# EAGLE design midi-switcher-dpdt (EAGLE 6.6.0)
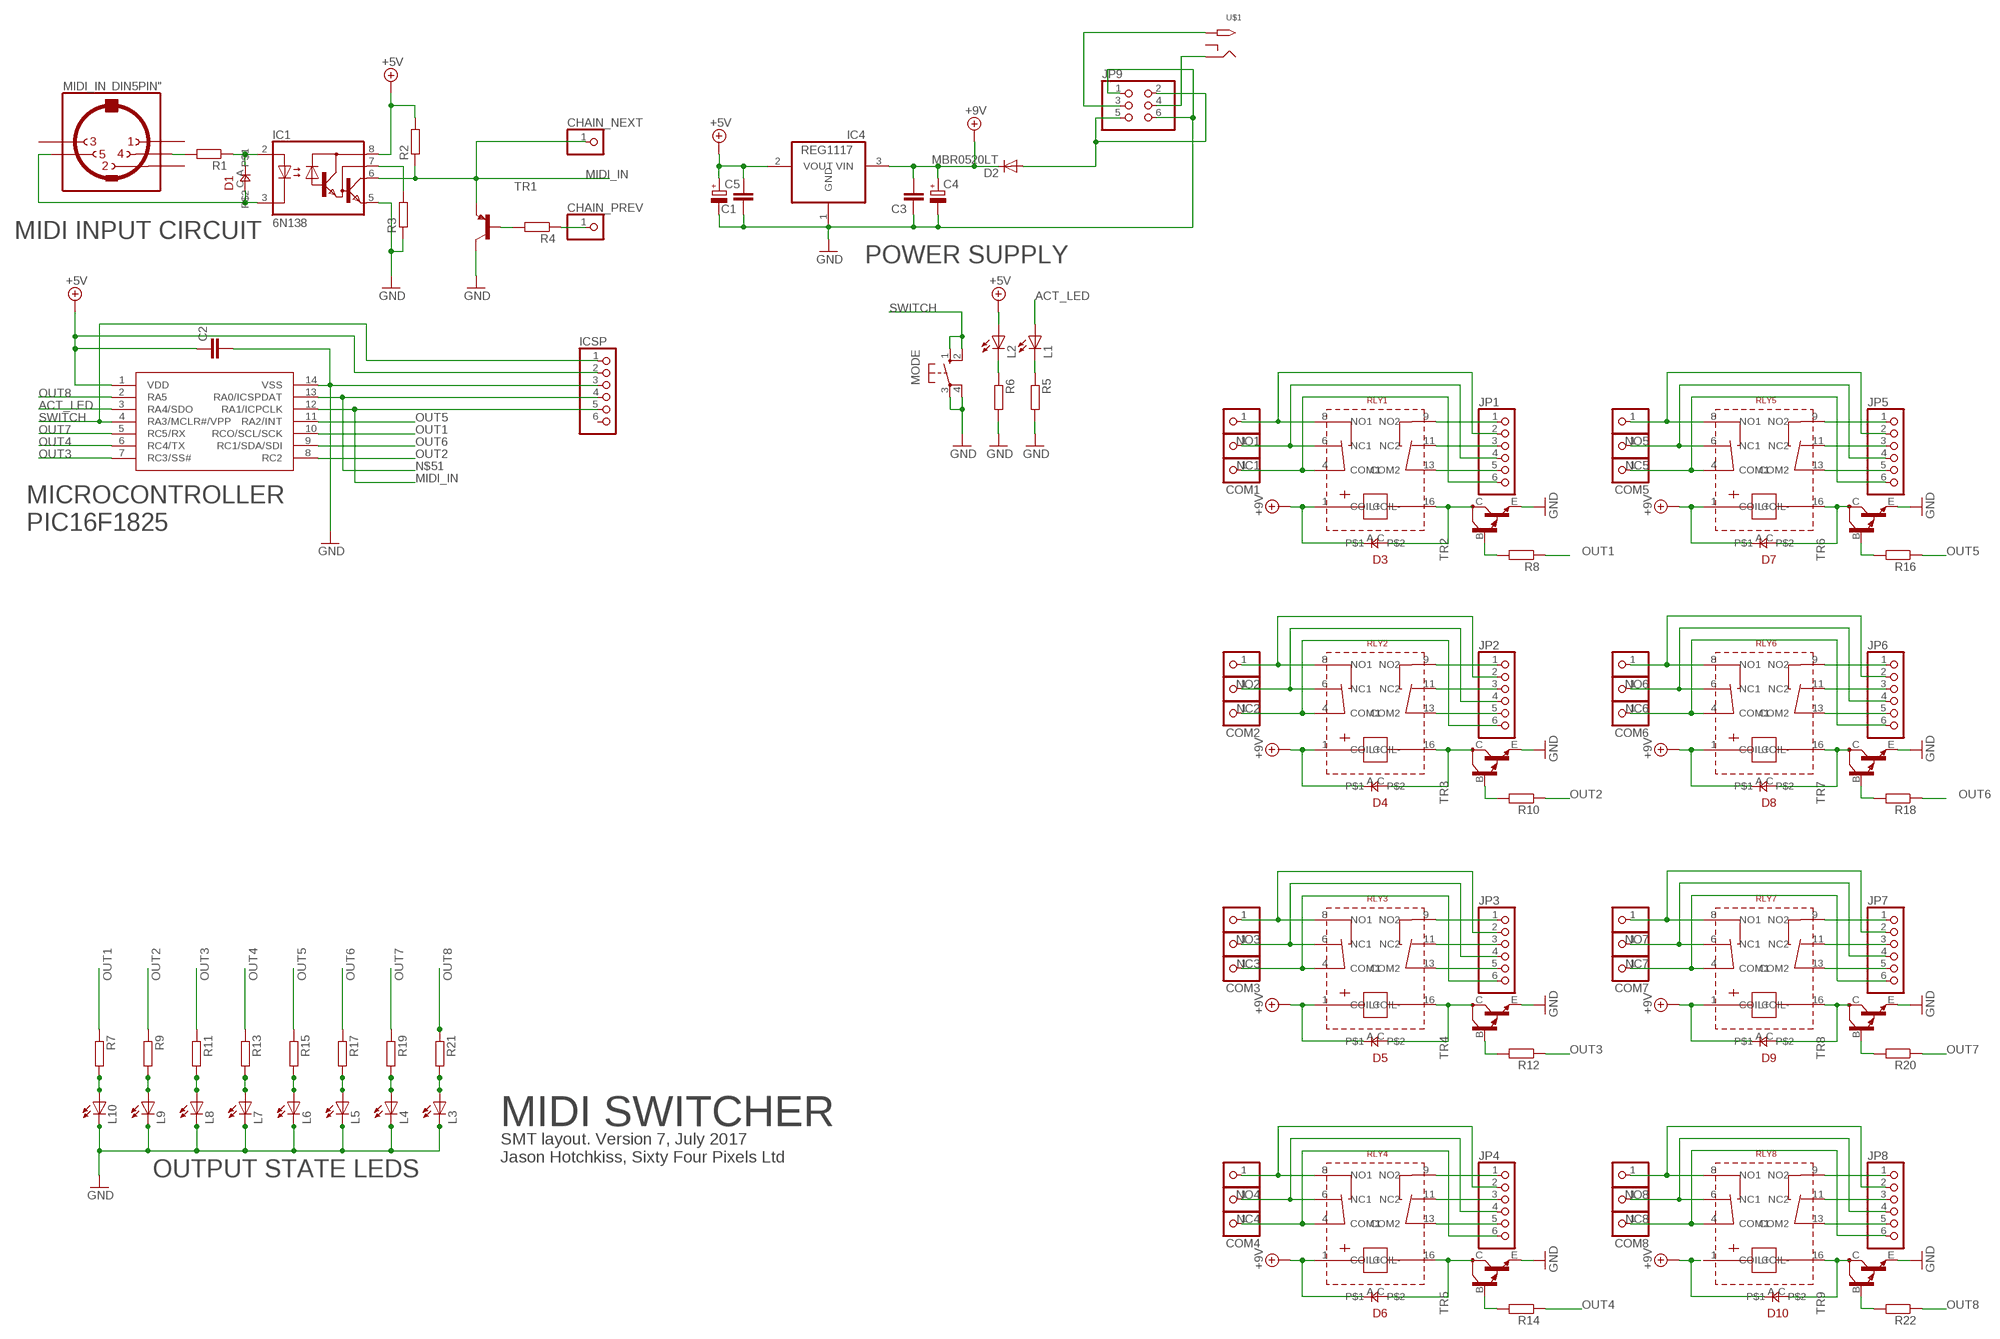
[diagram p0: schematic, sheet 1]

## Parts
C1  C-EUC0805  [C0805]
C2  C-EUC0805  [C0805]
C3  C-EUC0805  [C0805]
C4  CPOL-EUE2,5-6E  [E2,5-6E]
C5  CPOL-EUE2,5-6E  [E2,5-6E]
CHAIN_NEXT  PINHD-1X1  [1X01]
CHAIN_PREV  PINHD-1X1  [1X01]
COM1  PINHD-1X1  [1X01]
COM2  PINHD-1X1  [1X01]
COM3  PINHD-1X1  [1X01]
COM4  PINHD-1X1  [1X01]
COM5  PINHD-1X1  [1X01]
COM6  PINHD-1X1  [1X01]
COM7  PINHD-1X1  [1X01]
COM8  PINHD-1X1  [1X01]
D1  0805DIODE  [0805DIODE]
D2  MBR0520LT  [SOD123]
D3  0805DIODE  [0805DIODE]
D4  0805DIODE  [0805DIODE]
D5  0805DIODE  [0805DIODE]
D6  0805DIODE  [0805DIODE]
D7  0805DIODE  [0805DIODE]
D8  0805DIODE  [0805DIODE]
D9  0805DIODE  [0805DIODE]
D10  0805DIODE  [0805DIODE]
IC1  6N138  [DIL08]
IC2  PIC16F1825SO14  [SO14]
IC4  REG1117  [SOT223]
ICSP  HEADER-1X6  [1X06_OVAL]
JP1  PINHD-1X6  [1X06]
JP2  PINHD-1X6  [1X06]
JP3  PINHD-1X6  [1X06]
JP4  PINHD-1X6  [1X06]
JP5  PINHD-1X6  [1X06]
JP6  PINHD-1X6  [1X06]
JP7  PINHD-1X6  [1X06]
JP8  PINHD-1X6  [1X06]
JP9  PINHD-2X3  [2X03]
L1  LEDCHIP-LED0805  [CHIP-LED0805]
L2  LEDCHIP-LED0805  [CHIP-LED0805]
L3  LEDCHIP-LED0805  [CHIP-LED0805]
L4  LEDCHIP-LED0805  [CHIP-LED0805]
L5  LEDCHIP-LED0805  [CHIP-LED0805]
L6  LEDCHIP-LED0805  [CHIP-LED0805]
L7  LEDCHIP-LED0805  [CHIP-LED0805]
L8  LEDCHIP-LED0805  [CHIP-LED0805]
L9  LEDCHIP-LED0805  [CHIP-LED0805]
L10  LEDCHIP-LED0805  [CHIP-LED0805]
MIDI_IN  DIN5PIN"  [TRUCONN90]
MODE  10-XX  [B3F-10XX]
NC1  PINHD-1X1  [1X01]
NC2  PINHD-1X1  [1X01]
NC3  PINHD-1X1  [1X01]
NC4  PINHD-1X1  [1X01]
NC5  PINHD-1X1  [1X01]
NC6  PINHD-1X1  [1X01]
NC7  PINHD-1X1  [1X01]
NC8  PINHD-1X1  [1X01]
NO1  PINHD-1X1  [1X01]
NO2  PINHD-1X1  [1X01]
NO3  PINHD-1X1  [1X01]
NO4  PINHD-1X1  [1X01]
NO5  PINHD-1X1  [1X01]
NO6  PINHD-1X1  [1X01]
NO7  PINHD-1X1  [1X01]
NO8  PINHD-1X1  [1X01]
R1  R-EU_R0805  [R0805]
R2  R-EU_R0805  [R0805]
R3  R-EU_R0805  [R0805]
R4  R-EU_R0805  [R0805]
R5  R-EU_R0805  [R0805]
R6  R-EU_R0805  [R0805]
R7  R-EU_R0805  [R0805]
R8  R-EU_R0805  [R0805]
R9  R-EU_R0805  [R0805]
R10  R-EU_R0805  [R0805]
R11  R-EU_R0805  [R0805]
R12  R-EU_R0805  [R0805]
R13  R-EU_R0805  [R0805]
R14  R-EU_R0805  [R0805]
R15  R-EU_R0805  [R0805]
R16  R-EU_R0805  [R0805]
R17  R-EU_R0805  [R0805]
R18  R-EU_R0805  [R0805]
R19  R-EU_R0805  [R0805]
R20  R-EU_R0805  [R0805]
R21  R-EU_R0805  [R0805]
R22  R-EU_R0805  [R0805]
RLY1  HFD2RELAY  [HFD2RELAY]
RLY2  HFD2RELAY  [HFD2RELAY]
RLY3  HFD2RELAY  [HFD2RELAY]
RLY4  HFD2RELAY  [HFD2RELAY]
RLY5  HFD2RELAY  [HFD2RELAY]
RLY6  HFD2RELAY  [HFD2RELAY]
RLY7  HFD2RELAY  [HFD2RELAY]
RLY8  HFD2RELAY  [HFD2RELAY]
TR1  MMBT3906LT1-PNP-SOT23-BEC  [SOT23-BEC]
TR2  MMBTA13LT1-NPN_DARL-SOT23-BEC  [SOT23-BEC]
TR3  MMBTA13LT1-NPN_DARL-SOT23-BEC  [SOT23-BEC]
TR4  MMBTA13LT1-NPN_DARL-SOT23-BEC  [SOT23-BEC]
TR5  MMBTA13LT1-NPN_DARL-SOT23-BEC  [SOT23-BEC]
TR6  MMBTA13LT1-NPN_DARL-SOT23-BEC  [SOT23-BEC]
TR7  MMBTA13LT1-NPN_DARL-SOT23-BEC  [SOT23-BEC]
TR8  MMBTA13LT1-NPN_DARL-SOT23-BEC  [SOT23-BEC]
TR9  MMBTA13LT1-NPN_DARL-SOT23-BEC  [SOT23-BEC]
U$1  2.1MMJACKTHM  [PJ-102A]

## Nets
+5V: C1.2 C2.1 C5.+ IC1.8(VCC) IC2.1(VDD) IC4.2(VOUT) ICSP.2 L2.A R2.2
+9V: C3.2 C4.+ D2.C D3.A D4.A D5.A D6.A D7.A D8.A D9.A D10.A IC4.3(VIN) RLY1.1(COIL+) RLY2.1(COIL+) RLY3.1(COIL+) RLY4.1(COIL+) RLY5.1(COIL+) RLY6.1(COIL+) RLY7.1(COIL+) RLY8.1(COIL+)
ACT_LED: IC2.3(RA4/SDO) L1.A
GND: C1.1 C2.2 C3.1 C4.- C5.- IC1.5(GND) IC2.14(VSS) IC4.1(GND) ICSP.3 JP9.1 JP9.6 L3.C L4.C L5.C L6.C L7.C L8.C L9.C L10.C MODE.3(P) MODE.4(P1) R3.1 R5.2 R6.2 TR1.C TR2.E TR3.E TR4.E TR5.E TR6.E TR7.E TR8.E TR9.E
MIDI_IN: CHAIN_NEXT.1 IC1.6(VO) IC2.12(RA1/ICPCLK) ICSP.5 R2.1 TR1.E
N$1: D1.C IC1.3(C) MIDI_IN.5
N$2: MIDI_IN.4 R1.2
N$3: D1.A IC1.2(A) R1.1
N$4: IC1.7(VB) R3.2
N$5: L1.C R5.1
N$6: L10.A R7.2
N$7: L9.A R9.2
N$8: D3.C RLY1.16(COIL-) TR2.C
N$9: R8.2 TR2.B
N$10: JP9.3 U$1.TIP
N$11: D4.C RLY2.16(COIL-) TR3.C
N$12: R10.2 TR3.B
N$13: JP9.4 U$1.RING
N$14: D5.C RLY3.16(COIL-) TR4.C
N$15: R12.2 TR4.B
N$16: R4.2 TR1.B
N$18: CHAIN_PREV.1 R4.1
N$19: D6.C RLY4.16(COIL-) TR5.C
N$20: R14.2 TR5.B
N$21: D2.A JP9.2 JP9.5
N$23: JP1.2 NO1.1 RLY1.8(NO1)
N$24: L8.A R11.2
N$25: JP1.4 NC1.1 RLY1.6(NC1)
N$26: JP5.5 RLY5.13(COM2)
N$27: JP2.2 NO2.1 RLY2.8(NO1)
N$28: L2.C R6.1
N$29: JP2.4 NC2.1 RLY2.6(NC1)
N$30: COM2.1 JP2.6 RLY2.4(COM1)
N$31: JP3.2 NO3.1 RLY3.8(NO1)
N$32: JP3.4 NC3.1 RLY3.6(NC1)
N$33: L7.A R13.2
N$34: COM3.1 JP3.6 RLY3.4(COM1)
N$35: L6.A R15.2
N$36: L5.A R17.2
N$37: L4.A R19.2
N$38: L3.A R21.2
N$39: JP4.2 NO4.1 RLY4.8(NO1)
N$40: JP4.4 NC4.1 RLY4.6(NC1)
N$41: COM4.1 JP4.6 RLY4.4(COM1)
N$42: JP5.2 NO5.1 RLY5.8(NO1)
N$43: JP5.4 NC5.1 RLY5.6(NC1)
N$44: COM5.1 JP5.6 RLY5.4(COM1)
N$45: JP6.2 NO6.1 RLY6.8(NO1)
N$46: JP6.4 NC6.1 RLY6.6(NC1)
N$47: COM6.1 JP6.6 RLY6.4(COM1)
N$48: JP7.2 NO7.1 RLY7.8(NO1)
N$49: JP7.4 NC7.1 RLY7.6(NC1)
N$50: COM7.1 JP7.6 RLY7.4(COM1)
N$51: IC2.13(RA0/ICSPDAT) ICSP.4
N$52: JP8.2 NO8.1 RLY8.8(NO1)
N$53: JP8.4 NC8.1 RLY8.6(NC1)
N$55: COM8.1 JP8.6 RLY8.4(COM1)
N$56: D7.C RLY5.16(COIL-) TR6.C
N$57: R16.2 TR6.B
N$59: D8.C RLY6.16(COIL-) TR7.C
N$60: R18.2 TR7.B
N$62: D9.C RLY7.16(COIL-) TR8.C
N$63: R20.2 TR8.B
N$65: D10.C RLY8.16(COIL-) TR9.C
N$66: R22.2 TR9.B
N$68: JP5.3 RLY5.11(NC2)
N$69: JP1.5 RLY1.13(COM2)
N$70: JP1.3 RLY1.11(NC2)
N$71: JP1.1 RLY1.9(NO2)
N$72: JP5.1 RLY5.9(NO2)
N$73: COM1.1 JP1.6 RLY1.4(COM1)
N$74: JP2.1 RLY2.9(NO2)
N$75: JP2.3 RLY2.11(NC2)
N$76: JP2.5 RLY2.13(COM2)
N$77: JP3.5 RLY3.13(COM2)
N$78: JP3.1 RLY3.9(NO2)
N$79: JP3.3 RLY3.11(NC2)
N$80: JP4.5 RLY4.13(COM2)
N$81: JP4.3 RLY4.11(NC2)
N$82: JP4.1 RLY4.9(NO2)
N$88: JP6.5 RLY6.13(COM2)
N$89: JP6.3 RLY6.11(NC2)
N$90: JP6.1 RLY6.9(NO2)
N$94: JP7.5 RLY7.13(COM2)
N$95: JP7.3 RLY7.11(NC2)
N$96: JP7.1 RLY7.9(NO2)
N$100: JP8.5 RLY8.13(COM2)
N$101: JP8.3 RLY8.11(NC2)
N$102: JP8.1 RLY8.9(NO2)
OUT1: IC2.10(RCO/SCL/SCK) R7.1 R8.1
OUT2: IC2.8(RC2) R9.1 R10.1
OUT3: IC2.7(RC3/SS#) R11.1 R12.1
OUT4: IC2.6(RC4/TX) R13.1 R14.1
OUT5: IC2.11(RA2/INT) R15.1 R16.1
OUT6: IC2.9(RC1/SDA/SDI) R17.1 R18.1
OUT7: IC2.5(RC5/RX) R19.1 R20.1
OUT8: IC2.2(RA5) R21.1 R22.1
SWITCH: IC2.4(RA3/MCLR#/VPP) ICSP.1 MODE.1(S) MODE.2(S1)
Unconnected: ICSP.6 MIDI_IN.1 MIDI_IN.2 MIDI_IN.3 U$1.RING_SW

## Notes on the sheet
- MIDI INPUT CIRCUIT
- POWER SUPPLY
- MICROCONTROLLER 
  PIC16F1825
- MIDI SWITCHER
- SMT layout. Version 7, July 2017
  Jason Hotchkiss, Sixty Four Pixels Ltd
- OUTPUT STATE LEDS

## Library data of the parts
C1-C3 = rcl:C-EU: CAPACITOR, European symbol
C4 C5 = rcl:CPOL-EU: POLARIZED CAPACITOR, European symbol
CHAIN_NEXT CHAIN_PREV COM1-COM8 NC1-NC8 NO1-NO8 = adafruit:PINHD-1X1: Pin header 1x1 for 0.1" spacing With round pins
D1 D3-D10 = jasons_stuff:0805DIODE
D2 = diode:MBR0520LT: SCHOTTKY BARRIER RECTIFIER Source: http://onsemi.com .. MBR0520LT1-D.pdf
IC1 = optocoupler:6N138: MOTOROLA OPTO COUPLER
IC2 = jasons_stuff:PIC16F1825
IC4 = burr-brown:REG1117: 800mA and 1A Low Dropout (LDO) Positive Regulator 1.8V, 2.5V, 2.85V, 3.3V, 5V, and Adj; MPN: REG1117; OC_FARNELL: 1097566; OC_NEWARK: 14P6981
ICSP = microbuilder:HEADER-1X6: PIN HEADER
JP1-JP8 = pinhead:PINHD-1X6: PIN HEADER
JP9 = pinhead:PINHD-2X3: PIN HEADER
L1-L10 = led:LED: LED OSRAM: - CHIPLED LG R971, LG N971, LY N971, LG Q971, LY Q971, LO R971, LY R971 LH N974, LH R974 LS Q976, LO Q976, LY Q976 LO Q996 - Hyper CHIPLED LW Q18S LB Q993, LB Q99A, LB R99A - SideLED LS A670, LO A670, LY A670, LG A670, LP A670 LB A673, LV A673, LT A673, LW A673 LH A674 LY A675 LS A676, LA A676, LO A676, LY A676, LW A676 LS A679, LY A679, LG A679 - Hyper Micro SIDELED® LS Y876, LA Y876, LO Y876, LY Y876 LT Y87S - SmartLED LW L88C, LW L88S LB L89C, LB L89S, LG L890 LS L89K, LO L89K, LY L89K LS L896, LA L896, LO L896, LY L896 - TOPLED LS T670, LO T670, LY T670, LG T670, LP T670 LSG T670, LSP T670, LSY T670, LOP T670, LYG T670 LG T671, LOG T671, LSG T671 LB T673, LV T673, LT T673, LW T673 LH T674 LS T676, LA T676, LO T676, LY T676, LB T676, LH T676, LSB T676, LW T676 LB T67C, LV T67C, LT T67C, LS T67K, LO T67K, LY T67K, LW E67C LS E67B, LA E67B, LO E67B, LY E67B, LB E67C, LV E67C, LT E67C LW T67C LS T679, LY T679, LG T679 LS T770, LO T770, LY T770, LG T770, LP T770 LB T773, LV T773, LT T773, LW T773 LH T774 LS E675, LA E675, LY E675, LS T675 LS T776, LA T776, LO T776, LY T776, LB T776 LHGB T686 LT T68C, LB T68C - Hyper Mini TOPLED® LB M676 - Mini TOPLED Santana® LG M470 LS M47K, LO M47K, LY M47K Source: http://www.osram.convergy.de LUXEON: - LUMILED® LXK2-PW12-R00, LXK2-PW12-S00, LXK2-PW14-U00, LXK2-PW14-V00 LXK2-PM12-R00, LXK2-PM12-S00, LXK2-PM14-U00 LXK2-PE12-Q00, LXK2-PE12-R00, LXK2-PE12-S00, LXK2-PE14-T00, LXK2-PE14-U00 LXK2-PB12-K00, LXK2-PB12-L00, LXK2-PB12-M00, LXK2-PB14-N00, LXK2-PB14-P00, LXK2-PB14-Q00 LXK2-PR12-L00, LXK2-PR12-M00, LXK2-PR14-Q00, LXK2-PR14-R00 LXK2-PD12-Q00, LXK2-PD12-R00, LXK2-PD12-S00 LXK2-PH12-R00, LXK2-PH12-S00 LXK2-PL12-P00, LXK2-PL12-Q00, LXK2-PL12-R00 Source: www.luxeon.com KINGBRIGHT: KA-3528ASYC Source: www.kingbright.com
MIDI_IN = jasons_stuff:DIN5PIN: Female CONNECTOR 5 pins 90 deg. with shield, horizontal (DIN 41524)
MODE = switch-omron:10-XX: OMRON SWITCH
R1-R22 = rcl:R-EU_: RESISTOR, European symbol
RLY1-RLY8 = jason_eagle6:HFD2RELAY
TR1 = transistor:*-PNP-: PNP Transistror
TR2-TR9 = transistor:*-NPN_DARL-: NPN Darlington Transistor
U$1 = adafruit:2.1MMJACK: 2.1mm x 5.5mm THM DC jack with internal switch. Digikey part #PJ-102A, 4UCON part #05537 2.1mm x 5.5mm SMT DC jack with internal switch. Digikey part #PJ-002A-SMT, 4UCON part #03267 By microbuilder.eu & adafruit.com

## Board
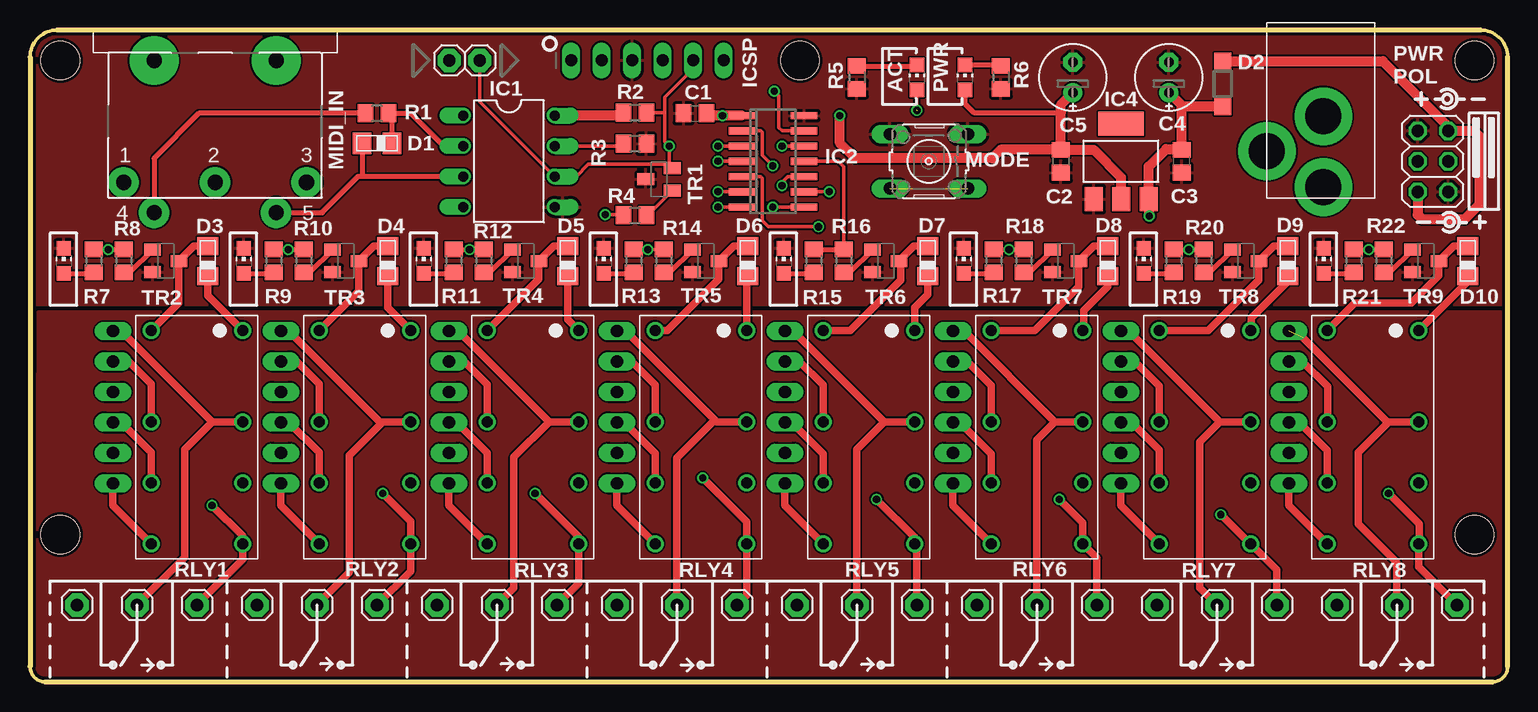
[diagram p1: board, top side]
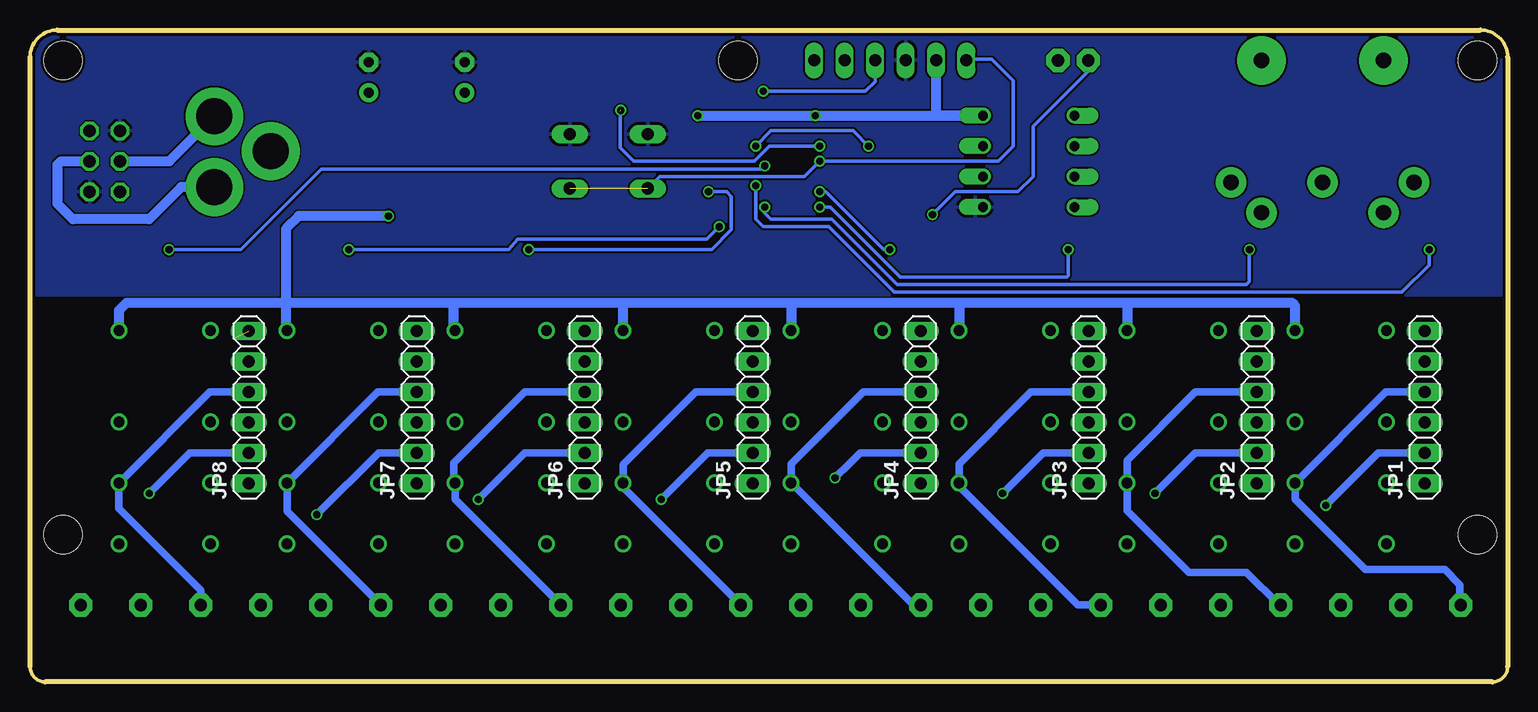
[diagram p2: board, bottom side, seen from below]

Size 123.14 x 54.36 mm. Coordinates in mm from the lower left corner, seen from the top.
Outline: 1.27,0 121.87,0 arc90 123.14,1.27 123.14,52.09 arc90 120.87,54.36 2.27,54.36 arc90 0,52.09 0,1.27 arc90 1.27,0
Copper layers (1*16): Top 0.035mm / dielectric 1.5mm / Bottom 0.035mm
Design rules "ITEADstudio_DRC": minimum track width 6mil, minimum drill 12mil, track to track 6mil, track to pad 6mil, pad to pad 6mil, via to via 6mil, smd to smd 0mil, copper to edge 10mil, drill to drill 10mil, minimum pad ring 10mil, minimum via ring 6mil, stop-mask expansion 2mil, vias tented up to drill 100mil, thermal gap 10mil
Holes 3.2 mm at 120.38,51.83 2.52,12.28 64.15,51.82 2.52,51.83 120.38,12.28

### Footprints (pad centres in the part's own frame; a part is rotated, then mirrored left to right if it is on the bottom)
C0805 = smd 1.3 x 1.5: 1 -0.95,0; 2 0.95,0
E2,5-6E = drill 0.813 pad 1.575: + -1.27,0 | drill 0.813 pad 1.575 octagon: - 1.27,0
1X01 = drill 1.016 pad 1.93 octagon: 1 0,0
0805DIODE = smd 1.524 x 1.778: A -1.262,-0.005; C 1.238,-0.005
SOD123 = smd 1.4 x 1.4: A 1.9,0; C -1.9,0
DIL08 = drill 0.813 offset: 1 -3.81,-3.81; 2 -1.27,-3.81; 3 1.27,-3.81; 4 3.81,-3.81; 5 3.81,3.81; 6 1.27,3.81; 7 -1.27,3.81; 8 -3.81,3.81
SO14 = smd 0.6 x 2.2: 1 -3.81,-2.6; 2 -2.54,-2.6; 3 -1.27,-2.6; 4 0,-2.6; 5 1.27,-2.6; 6 2.54,-2.6; 7 3.81,-2.6; 8 3.81,2.6; 9 2.54,2.6; 10 1.27,2.6; 11 0,2.6; 12 -1.27,2.6; 13 -2.54,2.6; 14 -3.81,2.6
SOT223 = smd 1.499 x 2.007: 1 -2.261,-3.15; 2 0.025,-3.15; 3 2.311,-3.15 | smd 3.81 x 2.007: 4 0,3.15
1X06_OVAL = drill 1 long: 1 -6.35,0; 2 -3.81,0; 3 -1.27,0; 4 1.27,0; 5 3.81,0; 6 6.35,0
1X06 = drill 1.016 long: 1 -6.35,0; 2 -3.81,0; 3 -1.27,0; 4 1.27,0; 5 3.81,0; 6 6.35,0
2X03 = drill 1.016 octagon: 1 -2.54,-1.27; 2 -2.54,1.27; 3 0,-1.27; 4 0,1.27; 5 2.54,-1.27; 6 2.54,1.27
CHIP-LED0805 = smd 1.2 x 1.2: A 0,-1.05; C 0,1.05
TRUCONN90 = drill 1.27 pad 2.54: 1 7.62,5.08; 2 0,5.08; 3 -7.62,5.08; 4 5.08,7.62; 5 -5.08,7.62 | drill 1.27 pad 4.064: NC -5.08,-5.08; NC@ 5.08,-5.08
B3F-10XX = drill 1.016 long: 1 -3.251,2.261; 2 3.251,2.261; 3 -3.251,-2.261; 4 3.251,-2.261
R0805 = smd 1.3 x 1.5: 1 -0.95,0; 2 0.95,0
HFD2RELAY = drill 0.9: 1 -8.89,3.81; 4 -1.27,3.81; 6 3.81,3.81; 8 8.89,3.81; 9 8.89,-3.81; 11 3.81,-3.81; 13 -1.27,-3.81; 16 -8.89,-3.81
SOT23-BEC = smd 1 x 1.4: B -0.95,-1.1; C 0,1.1; E 0.95,-1.1
PJ-102A = drill 3 pad 4.8: RING 0.1,-3.39; RING_SW -4.6,-6.29; TIP 0.1,-9.29

### Placement (x,y rotation side)
C1  55.41,47.41 0 top
C2  85.9,43.42 270 top
C3  95.97,43.42 90 top
C4  94.91,50.41 90 top
C5  86.91,50.41 90 top
CHAIN_NEXT  37.48,51.82 0 top
CHAIN_PREV  34.94,51.82 0 top
COM1  8.91,6.41 0 top
COM2  23.91,6.41 0 top
COM3  38.91,6.41 0 top
COM4  53.91,6.41 0 top
COM5  68.91,6.41 0 top
COM6  83.91,6.41 0 top
COM7  98.91,6.41 0 top
COM8  113.91,6.41 0 top
D1  28.91,44.91 180 top
D2  99.39,49.86 90 top
D3  14.81,35.11 90 top
D4  29.81,35.11 90 top
D5  44.81,35.11 90 top
D6  59.81,35.11 90 top
D7  74.81,35.11 90 top
D8  89.81,35.11 90 top
D9  104.81,35.11 90 top
D10  119.81,35.11 90 top
IC1  39.91,43.41 270 top
IC2  61.91,43.41 270 top
IC4  90.91,43.41 0 top
ICSP  51.45,51.82 0 top
JP1  6.91,22.91 90 bottom
JP2  20.91,22.91 90 bottom
JP3  34.91,22.91 90 bottom
JP4  48.91,22.91 90 bottom
JP5  62.91,22.91 90 bottom
JP6  76.91,22.91 90 bottom
JP7  90.91,22.91 90 bottom
JP8  104.91,22.91 90 bottom
JP9  116.91,43.41 90 top
L1  73.91,50.41 0 top
L2  77.91,50.41 0 top
L3  107.81,35.11 0 top
L4  92.81,35.11 0 top
L5  77.81,35.11 0 top
L6  62.81,35.11 0 top
L7  47.81,35.11 0 top
L8  32.81,35.11 0 top
L9  17.81,35.11 0 top
L10  2.81,35.11 0 top
MIDI_IN  15.43,46.74 180 top
MODE  74.91,43.41 180 top
NC1  3.91,6.41 0 top
NC2  18.91,6.41 0 top
NC3  33.91,6.41 0 top
NC4  48.91,6.41 0 top
NC5  63.91,6.41 0 top
NC6  78.91,6.41 0 top
NC7  93.91,6.41 0 top
NC8  108.91,6.41 0 top
NO1  13.91,6.41 0 top
NO2  28.91,6.41 0 top
NO3  43.91,6.41 0 top
NO4  58.91,6.41 0 top
NO5  73.91,6.41 0 top
NO6  88.91,6.41 0 top
NO7  103.91,6.41 0 top
NO8  118.91,6.41 0 top
R1  28.91,47.41 180 top
R2  50.41,47.45 180 top
R3  50.41,44.87 180 top
R4  50.41,38.91 0 top
R5  68.91,50.41 270 top
R6  80.91,50.41 270 top
R7  5.31,35.11 270 top
R8  7.81,35.11 270 top
R9  20.31,35.11 270 top
R10  22.81,35.11 270 top
R11  35.31,35.11 270 top
R12  37.81,35.11 270 top
R13  50.31,35.11 270 top
R14  52.81,35.11 270 top
R15  65.31,35.11 270 top
R16  67.81,35.11 270 top
R17  80.31,35.11 270 top
R18  82.81,35.11 270 top
R19  95.31,35.11 270 top
R20  97.81,35.11 270 top
R21  110.31,35.11 270 top
R22  112.81,35.11 270 top
RLY1  13.91,20.41 270 top
RLY2  27.91,20.41 270 top
RLY3  41.91,20.41 270 top
RLY4  55.91,20.41 270 top
RLY5  69.91,20.41 270 top
RLY6  83.91,20.41 270 top
RLY7  97.91,20.41 270 top
RLY8  111.91,20.41 270 top
TR1  52.41,41.91 90 top
TR2  11.31,35.11 270 top
TR3  26.31,35.11 270 top
TR4  41.31,35.11 270 top
TR5  56.31,35.11 270 top
TR6  71.31,35.11 270 top
TR7  86.31,35.11 270 top
TR8  101.31,35.11 270 top
TR9  116.31,35.11 270 top
U$1  107.68,50.55 0 top

### Tracks (layer width: path | path; a pad name or v marks a point on that pad's centre or on a via)
+5V  (via drill 0.6)
  Top 0.305: 49.23,47.22 R2.2
  Top 0.406: L2.A 77.91,48.23 78.67,47.48 85.9,47.48
  Top 0.813: C2.1 88.63,44.37 90.94,42.06 IC4.2 | C2.1 85.9,47.48 85.9,48.13 C5.+ | C2.1 80.89,44.37 80.19,43.67 68.76,43.67 67.49,44.94 v67.49,47.22 | C1.2 56.54,47.22 v57.71,47.22 v57.72,47.22 IC2.1 | 49.23,47.22 IC1.8
  Bottom 0.813: v67.49,47.22 v57.71,47.22 IC1.8 47.64,47.22 ICSP.2
+9V  (via drill 0.6)
  Top 0.61: D4.A 29.82,31.2 RLY2.1 | D3.A 14.82,32.2 RLY1.1 | D5.A 44.82,30.2 RLY3.1 | D6.A 59.72,33.84 RLY4.1 | D7.A 74.82,32.31 73.72,31.22 RLY5.1 | D8.A 89.82,32.97 87.81,30.97 87.81,29.39 RLY6.1 | D9.A 104.82,33.37 101.78,30.33 101.78,29.36 RLY7.1 | D10.A 119.82,33.39 RLY8.1
  Top 0.813: 94.92,49.12 C4.+ 95.97,48.08 | 95.97,48.08 C3.2 95.91,44.43 94.67,44.43 93.22,42.98 IC4.3 93.22,38.89 v93.27,38.84 | D2.C 96.09,47.96 95.97,48.08
  Bottom 0.813: RLY1.1 17.72,31.36 17.96,31.6 31.66,31.6 | 31.66,31.6 45.79,31.6 | 45.79,31.6 59.72,31.6 | 59.72,31.6 73.84,31.6 | 73.84,31.6 87.81,31.6 | 87.81,31.6 101.78,31.6 | 101.78,31.6 115.12,31.6 115.72,31 RLY8.1 | RLY7.1 101.78,29.36 101.78,31.6 | RLY6.1 87.81,29.39 87.81,31.6 | RLY5.1 73.72,31.48 73.84,31.6 | 59.72,31.6 RLY4.1 | 45.79,31.6 45.72,31.53 RLY3.1 | 31.66,31.6 31.72,31.54 RLY2.1 | 101.78,31.6 101.78,37.82 100.76,38.84 v93.27,38.84
ACT_LED  (via drill 0.6)  (1 unrouted)
  Top 0.305: v57.33,44.68 IC2.3 | L1.A v73.91,47.66
  Bottom 0.305: v57.33,44.68 61.52,44.68 62.79,43.41 72.82,43.41 73.97,44.55 73.97,47.6
AGND
  pour Top: 0.69,30.84 0.56,0.49 123.37,0.49 123.5,30.84
GND
  pour Top: -3.09,56.41 -3.09,31.46 126.91,31.46 126.91,56.41
  pour Bottom: -1.09,56.37 -0.96,32.24 123.5,32.24 123.37,56.37
MIDI_IN  (via drill 0.6)
  Top 0.305: CHAIN_NEXT.1 37.48,48.38 IC1.6 45.51,42.14 46.54,43.16 53.21,43.16 TR1.E 53.27,43.1 v53.27,44.68 52.89,45.06 52.89,47.45 | 52.89,47.45 52.89,48.75 55.26,51.12 ICSP.5 | R2.1 | 52.89,47.45 R2.1 | R2.1 51.36,47.48 | IC2.12 62.92,44.68 v62.66,44.68
  Bottom 0.305: v53.27,44.68 54.54,45.95 61.39,45.95 v62.66,44.68
N$1
  Top 0.406: MIDI_IN.5 24.31,39.12 | 24.31,39.12 24.37,39.12 | IC1.3 27.61,42.14 | 27.61,42.14 27.33,42.14 24.31,39.12 | 27.61,42.14 27.67,42.2 D1.C
N$2
  Top 0.406: R1.2 14.08,47.41 10.34,43.67 10.34,39.13 MIDI_IN.4
N$3
  Top 0.406: R1.1 29.86,47.18 | IC1.2 34.48,44.68 31.75,47.41 R1.1 | D1.A 30.17,47.09 R1.1
N$4
  Top 0.305: IC1.7 49.27,44.68 R3.2
N$5
  Top 0.406: R5.1 73.81,51.36 L1.C
N$6
  Top 0.406: L10.A 5.21,34.06 R7.2
N$7
  Top 0.406: L9.A 20.21,34.06 R9.2
N$8
  Top 0.61: D3.C 13.65,36.34 TR2.C 12.41,31.61 RLY1.16
N$9
  Top 0.406: R8.2 8.31,34.16 TR2.B
N$10
  Bottom 0.813: U$1.TIP 110.54,41.26 113.21,38.59 119.56,38.59 120.83,39.86 120.83,43.16 120.58,43.41 JP9.3
N$11
  Top 0.61: D4.C 28.65,36.34 TR3.C 27.41,32.61 RLY2.16
N$12
  Top 0.406: R10.2 23.31,34.16 TR3.B
N$13
  Bottom 0.813: JP9.4 111.53,43.41 U$1.RING
N$14
  Top 0.61: D5.C 43.65,36.34 TR4.C 42.41,33.61 RLY3.16
N$15
  Top 0.406: R12.2 38.31,34.16 TR4.B
N$16
  Top 0.305: R4.2 51.46,38.91 TR1.B
N$18  (via drill 0.6)
  Top 0.305: v47.93,38.97 49.4,38.97 R4.1
  Bottom 0.305: CHAIN_PREV.1 34.94,50.94 39.55,46.33 39.55,42.14 40.82,40.87 46.03,40.87 v47.93,38.97
N$19
  Top 0.61: D6.C 58.65,36.34 TR5.C 57.41,33.59 53.12,29.3 RLY4.16
N$20
  Top 0.406: R14.2 53.31,34.16 TR5.B
N$21
  Top 0.813: JP9.2 115.64,38.95 116,38.59 119.56,38.59 120.83,39.86 120.83,45.44 120.33,45.95 JP9.5 118.18,46.32 112.74,51.76 D2.A
N$23  (via drill 0.6)
  Top 0.61: NO1.1 17.72,10.22 RLY1.8 17.72,12.16 v15.17,14.71
  Bottom 0.61: JP1.2 10.78,19.1 v15.17,14.71
N$24
  Top 0.406: L8.A 35.21,34.06 R11.2
N$25
  Bottom 0.61: JP1.4 10.14,24.18 RLY1.6 17.71,16.58 17.71,15.22 11.86,9.38 5.26,9.38 3.99,8.11 3.99,6.49 NC1.1
N$26
  Top 0.61: RLY5.13 66.1,24.74 64.12,26.72 JP5.5
N$27  (via drill 0.6)
  Top 0.61: NO2.1 31.72,9.22 RLY2.8 31.72,13.4 v29.39,15.73
  Bottom 0.61: JP2.2 26.02,19.1 v29.39,15.73
N$28
  Top 0.406: L2.C 80.81,51.46 R6.1
N$29
  Bottom 0.61: JP2.4 26.02,24.18 31.72,18.48 RLY2.6 31.72,14.25 26.6,9.12 21.77,9.12 19.05,6.41 NC2.1
N$30
  Top 0.61: JP2.6 21.58,29.26 29.16,21.68 29.39,21.68 | RLY2.4 29.39,21.68 | COM2.1 23.91,6.44 26.6,9.12 26.6,18.88 29.39,21.68
N$31  (via drill 0.6)
  Top 0.61: NO3.1 45.72,8.22 RLY3.8 45.72,12.1 v42.09,15.73
  Bottom 0.61: JP3.2 38.72,19.1 39.55,18.27 v42.09,15.73
N$32
  Bottom 0.61: JP3.4 39.74,24.18 45.72,18.19 RLY3.6 45.72,16.31 35.82,6.41 NC3.1
N$33
  Top 0.406: L7.A 50.21,34.06 R13.2
N$34
  Top 0.61: JP3.6 35.67,29.26 43.25,21.68 | RLY3.4 43.25,21.68 | COM3.1 38.91,6.45 40.31,7.85 40.31,18.74 43.25,21.68
N$35
  Top 0.406: L6.A 65.21,34.06 R15.2
N$36
  Top 0.406: L5.A 80.21,34.06 R17.2
N$37
  Top 0.406: L4.A 95.21,34.06 R19.2
N$38
  Top 0.406: L3.A 110.21,34.06 R21.2
N$39  (via drill 0.6)
  Top 0.61: NO4.1 59.72,7.22 RLY4.8 59.72,13.34 v56.06,17
  Bottom 0.61: JP4.2 53.96,19.1 54.79,18.27 v56.06,17
N$40
  Bottom 0.61: JP4.4 53.71,24.18 59.72,18.16 RLY4.6 49.53,6.41 NC4.1
N$41
  Top 0.61: JP4.6 49.64,29.26 57.08,21.82 | 57.08,21.82 57.22,21.68 RLY4.4 | COM4.1 53.91,18.66 57.08,21.82
N$42  (via drill 0.6)
  Top 0.61: NO5.1 73.91,11.33 RLY5.8 73.72,12.04 v70.54,15.22
  Bottom 0.61: JP5.2 66.66,19.1 v70.54,15.22
N$43
  Bottom 0.61: JP5.4 67.68,24.18 73.72,18.13 RLY5.6 73.72,16.22 NC5.1
N$44
  Top 0.61: JP5.6 63.61,29.26 71.19,21.68 | RLY5.4 71.19,21.68 | COM5.1 68.91,19.39 71.19,21.68
N$45  (via drill 0.6)
  Top 0.61: NO6.1 88.91,10.33 RLY6.8 87.72,13.28 v85.78,15.22
  Bottom 0.61: JP6.2 81.9,19.1 v85.78,15.22
N$46
  Bottom 0.61: JP6.4 81.9,24.18 87.81,18.27 87.81,16.69 RLY6.6 87.72,15.22 NC6.1
N$47
  Top 0.61: JP6.6 77.84,29.26 85.42,21.68 | RLY6.4 85.42,21.68 | COM6.1 83.91,20.17 85.42,21.68
N$48  (via drill 0.6)
  Top 0.61: NO7.1 103.91,9.33 RLY7.8 101.67,11.52 v99.24,13.95
  Bottom 0.61: JP7.2 94.09,19.1 v99.24,13.95
N$49
  Bottom 0.61: JP7.4 94.14,24.18 RLY7.6 101.72,14.22 NC7.1
N$50
  Top 0.61: 99.13,21.68 91.55,29.26 JP7.6 | 99.13,21.68 RLY7.4 | COM7.1 97.46,7.85 97.46,20.01 99.13,21.68
N$51  (via drill 0.6)
  Top 0.305: IC2.13 62.67,45.95 62.41,46.21 62.41,48.87 v62.03,49.25
  Bottom 0.305: v62.03,49.25 53.52,49.25 52.72,50.05 ICSP.4
N$52  (via drill 0.6)
  Top 0.61: NO8.1 115.72,9.6 RLY8.8 115.75,11.55 115.75,13.19 v113.21,15.73
  Bottom 0.61: JP8.2 109.84,19.1 v113.21,15.73
N$53
  Bottom 0.61: JP8.4 108.14,24.18 RLY8.6 115.75,16.57 115.75,14.46 108.91,7.62 NC8.1
N$55  (1 unrouted)
  Top 0.61: 106.1,28.68 113.1,21.68 113.21,21.68 | 113.21,21.68 RLY8.4 | COM8.1 113.91,9.95 110.67,13.19 110.67,19.14 113.21,21.68
N$56
  Top 0.61: D7.C 73.65,36.34 TR6.C 72.57,34.95 72.57,33.51 68.36,29.3 RLY5.16
N$57
  Top 0.406: R16.2 68.31,34.16 TR6.B
N$59
  Top 0.61: D8.C 88.65,36.34 TR7.C 87.41,32.98 83.73,29.3 RLY6.16
N$60
  Top 0.406: R18.2 83.31,34.16 TR7.B
N$62
  Top 0.61: D9.C 103.65,36.34 TR8.C 102.41,33.51 102.42,33.51 98.21,29.3 RLY7.16
N$63
  Top 0.406: R20.2 98.31,34.16 TR8.B
N$65
  Top 0.61: D10.C 118.65,36.34 TR9.C 117.41,33.9 115.12,31.6 110.41,31.6 RLY8.16
N$66
  Top 0.406: R22.2 113.31,34.16 TR9.B
N$68
  Top 0.61: RLY5.11 66.1,19.02 63.49,21.64 JP5.3
N$69
  Top 0.61: JP1.5 8.24,26.72 10.1,24.86 RLY1.13
N$70
  Top 0.61: JP1.3 7.61,21.64 10.1,19.14 RLY1.11
N$71
  Top 0.61: JP1.1 6.91,14.71 RLY1.9
N$72
  Top 0.61: JP5.1 62.91,14.71 RLY5.9
N$73
  Top 0.61: RLY1.4 15.19,21.68 | 15.19,21.68 7.61,29.26 JP1.6 | COM1.1 8.91,6.42 12.88,10.39 12.88,19.37 15.19,21.68
N$74
  Top 0.61: JP2.1 20.91,14.71 RLY2.9
N$75
  Top 0.61: RLY2.11 24.1,19.11 21.58,21.64 JP2.3
N$76
  Top 0.61: JP2.5 22.21,26.72 24.1,24.83 RLY2.13
N$77
  Top 0.61: RLY3.13 38.1,24.8 36.18,26.72 JP3.5
N$78
  Top 0.61: JP3.1 34.91,14.71 RLY3.9
N$79
  Top 0.61: RLY3.11 38.1,19.08 35.55,21.64 JP3.3
N$80
  Top 0.61: RLY4.13 52.1,24.77 50.35,26.52 49.11,26.52 JP4.5
N$81
  Top 0.61: JP4.3 49.52,21.64 52.1,19.05 RLY4.11
N$82
  Top 0.61: JP4.1 48.91,14.71 RLY4.9
N$88
  Top 0.61: RLY6.13 80.1,24.71 78.09,26.72 JP6.5
N$89
  Top 0.61: RLY6.11 80.1,18.99 77.97,21.12 77.65,21.44 77.46,21.64 JP6.3
N$90
  Top 0.61: JP6.1 76.91,14.71 RLY6.9
N$94
  Top 0.61: RLY7.13 94.1,24.68 92.06,26.72 JP7.5
N$95
  Top 0.61: RLY7.11 94.1,19.34 91.81,21.64 JP7.3
N$96
  Top 0.61: JP7.1 90.91,14.71 RLY7.9
N$100
  Top 0.61: JP8.5 106.03,26.72 108.13,24.62 108.13,21.71 RLY8.13
N$101
  Top 0.61: RLY8.11 108.1,19.31 105.78,21.64 JP8.3
N$102
  Top 0.61: JP8.1 104.91,14.71 RLY8.9
OUT1  (via drill 0.6)
  Top 0.305: R8.1 v6.54,36.06 v6.53,36.05 | IC2.10 63.17,42.14 62.66,41.63 v62.66,41.38
  Top 0.406: R7.1 R8.1
  Bottom 0.305: v6.53,36.05 6.53,34.78 8.82,32.49 51.11,32.49 56.57,37.95 62.03,37.95 62.66,38.59 v62.66,41.38
OUT2  (via drill 0.6)
  Top 0.305: R10.1 v21.53,36.06 v21.52,36.05 | IC2.8 v61.9,39.6
  Top 0.406: R9.1 R10.1
  Bottom 0.305: v21.52,36.05 21.52,33.38 21.77,33.12 50.85,33.12 56.31,38.59 61.39,38.59 61.9,39.09 v61.9,39.6
OUT3  (via drill 0.6)
  Top 0.305: R12.1 v36.64,36.06 v36.63,36.05 | IC2.7 v57.34,39.6 v57.33,39.6
  Top 0.406: R11.1 R12.1
  Bottom 0.305: v36.63,36.05 36.63,33.89 36.76,33.76 50.6,33.76 51.62,34.78 52.57,35.73 56.44,39.6 v57.33,39.6
OUT4  (via drill 0.6)
  Top 0.305: v57.33,40.87 IC2.6 | R14.1 v51.49,36.06 R13.1
  Bottom 0.305: v57.33,40.87 56.82,40.87 52.01,36.06 v51.49,36.06
OUT5
  Top 0.305: IC2.11 67.37,43.41 67.81,42.96 R16.1
  Top 0.406: R15.1 R16.1
OUT6  (via drill 0.6)
  Top 0.305: IC2.9 v66.6,40.87
  Top 0.406: R17.1 v81.59,36.06 R18.1
  Bottom 0.305: v81.59,36.06 81.58,36.05 66.35,36.05 64.7,37.7 64.7,40.48 65.08,40.87 65.59,40.87 v66.6,40.87
OUT7  (via drill 0.6)
  Top 0.305: R19.1 v96.56,36.06 v96.57,36.05 | IC2.5 60.89,42.14 61.01,42.01 61.01,38.46 61.52,37.95 v65.71,37.95
  Top 0.406: R19.1 R20.1
  Bottom 0.305: v96.57,36.05 83.24,36.05 82.48,36.93 66.73,36.93 v65.71,37.95
OUT8  (via drill 0.6)
  Top 0.305: R21.1 111.55,36.06 v111.56,36.05 | IC2.2 60.89,45.95 61.01,45.82 61.01,43.92 v61.9,43.03
  Top 0.406: R21.1 R22.1
  Bottom 0.305: v111.56,36.05 105.59,36.05 98.86,42.78 62.16,42.78 v61.9,43.03
SWITCH  (via drill 0.6)  (1 unrouted)
  Top 0.305: IC2.4 v57.34,43.41 v57.33,43.41
  Bottom 0.305: MODE.2 70.66,42.14 58.6,42.14 v57.33,43.41 42.47,43.41 41.2,44.68 41.2,50.14 42.98,51.92 45,51.92 ICSP.1

### Text on the board
tPlace: PWR / POL
tNames: ICSP | ACT | PWR | MODE
tDocu: A | B | C | D | E | F | G | H | A | B | C | D | E | F | G | H